# Altium schematic sheet SENSORS_SMALL_SCH.SchDoc
size A2; SheetNumber: 1; SheetTotal: 1
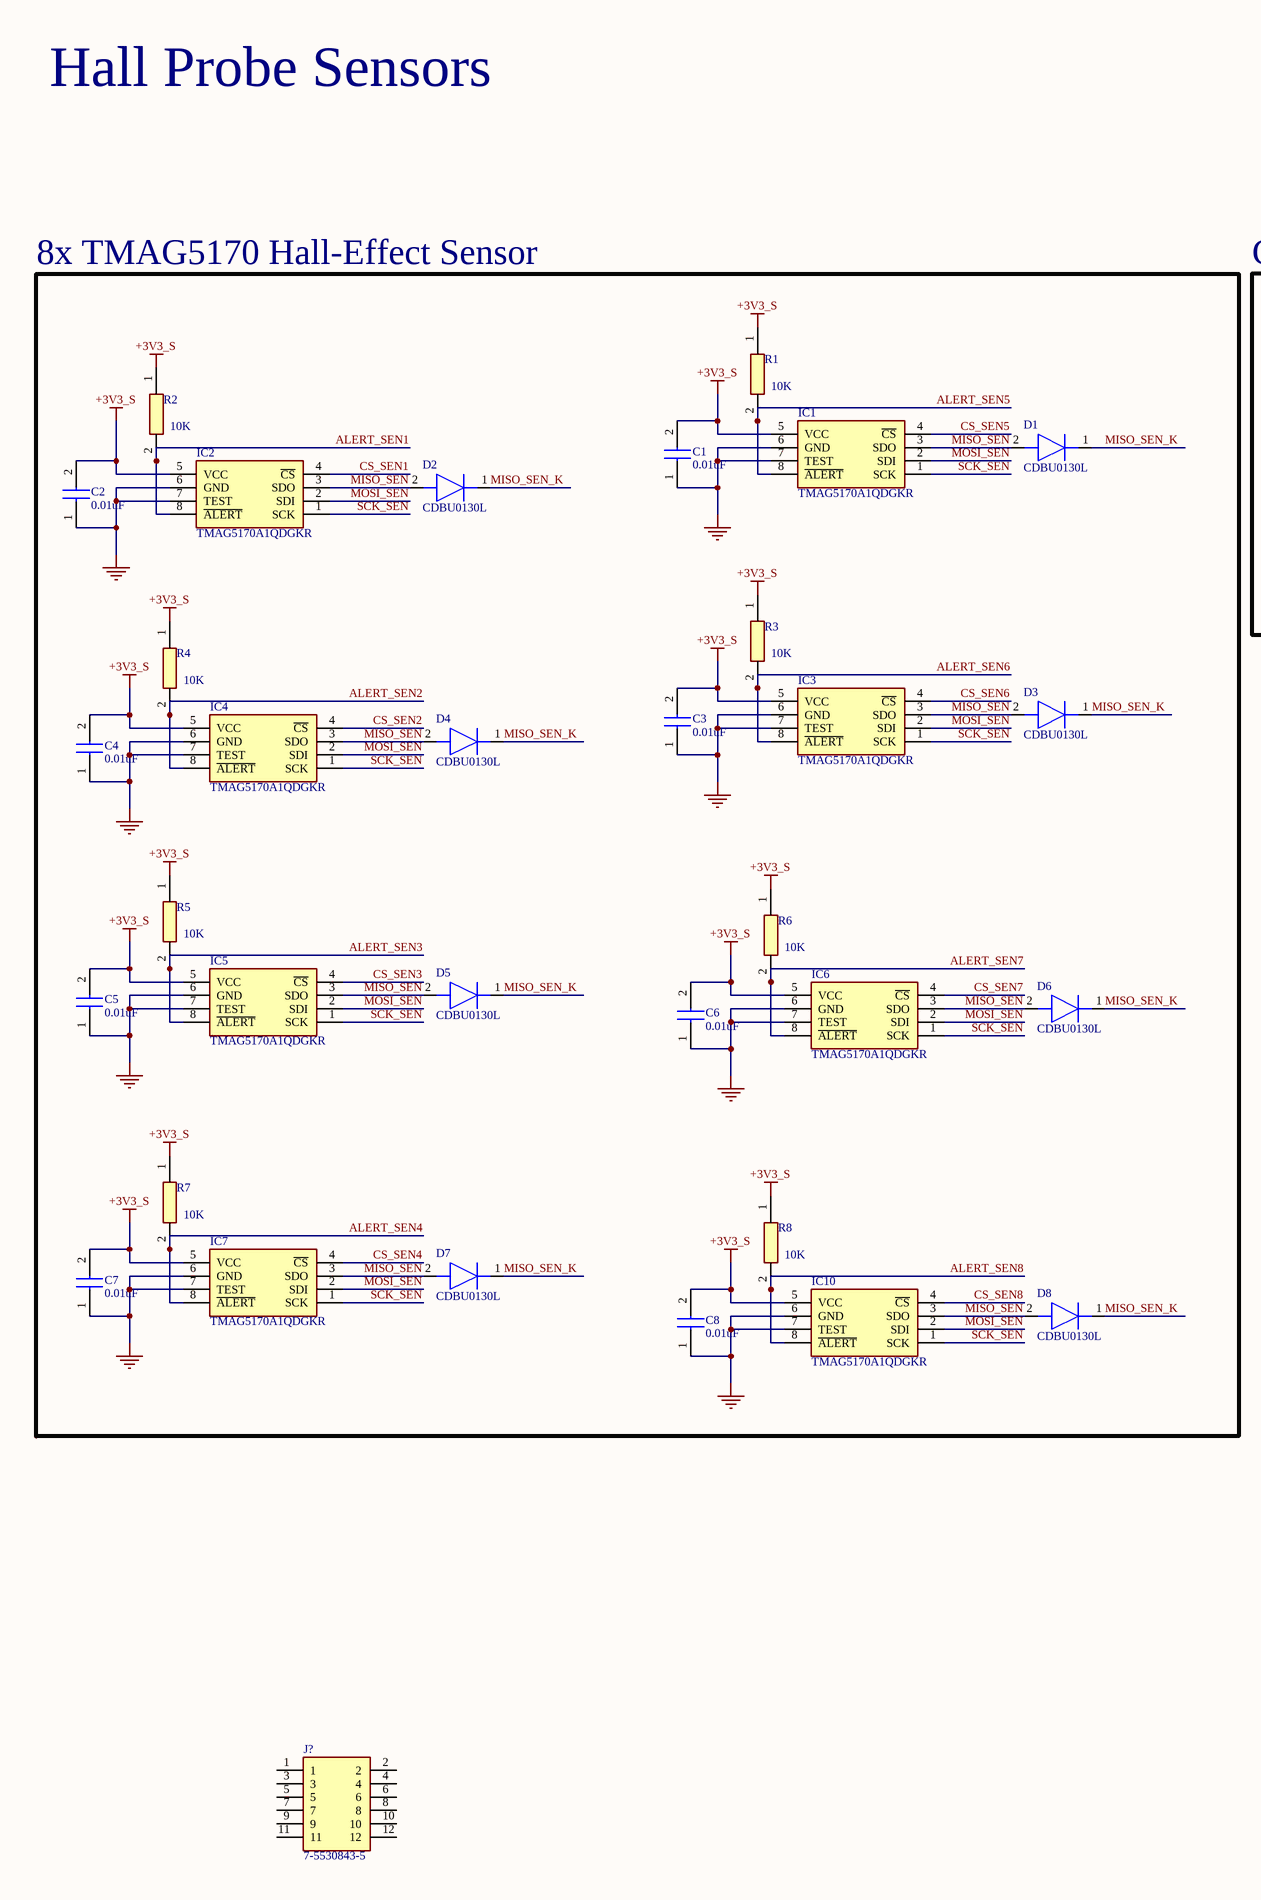
[diagram p0: SENSORS_SMALL_SCH.SchDoc, left]
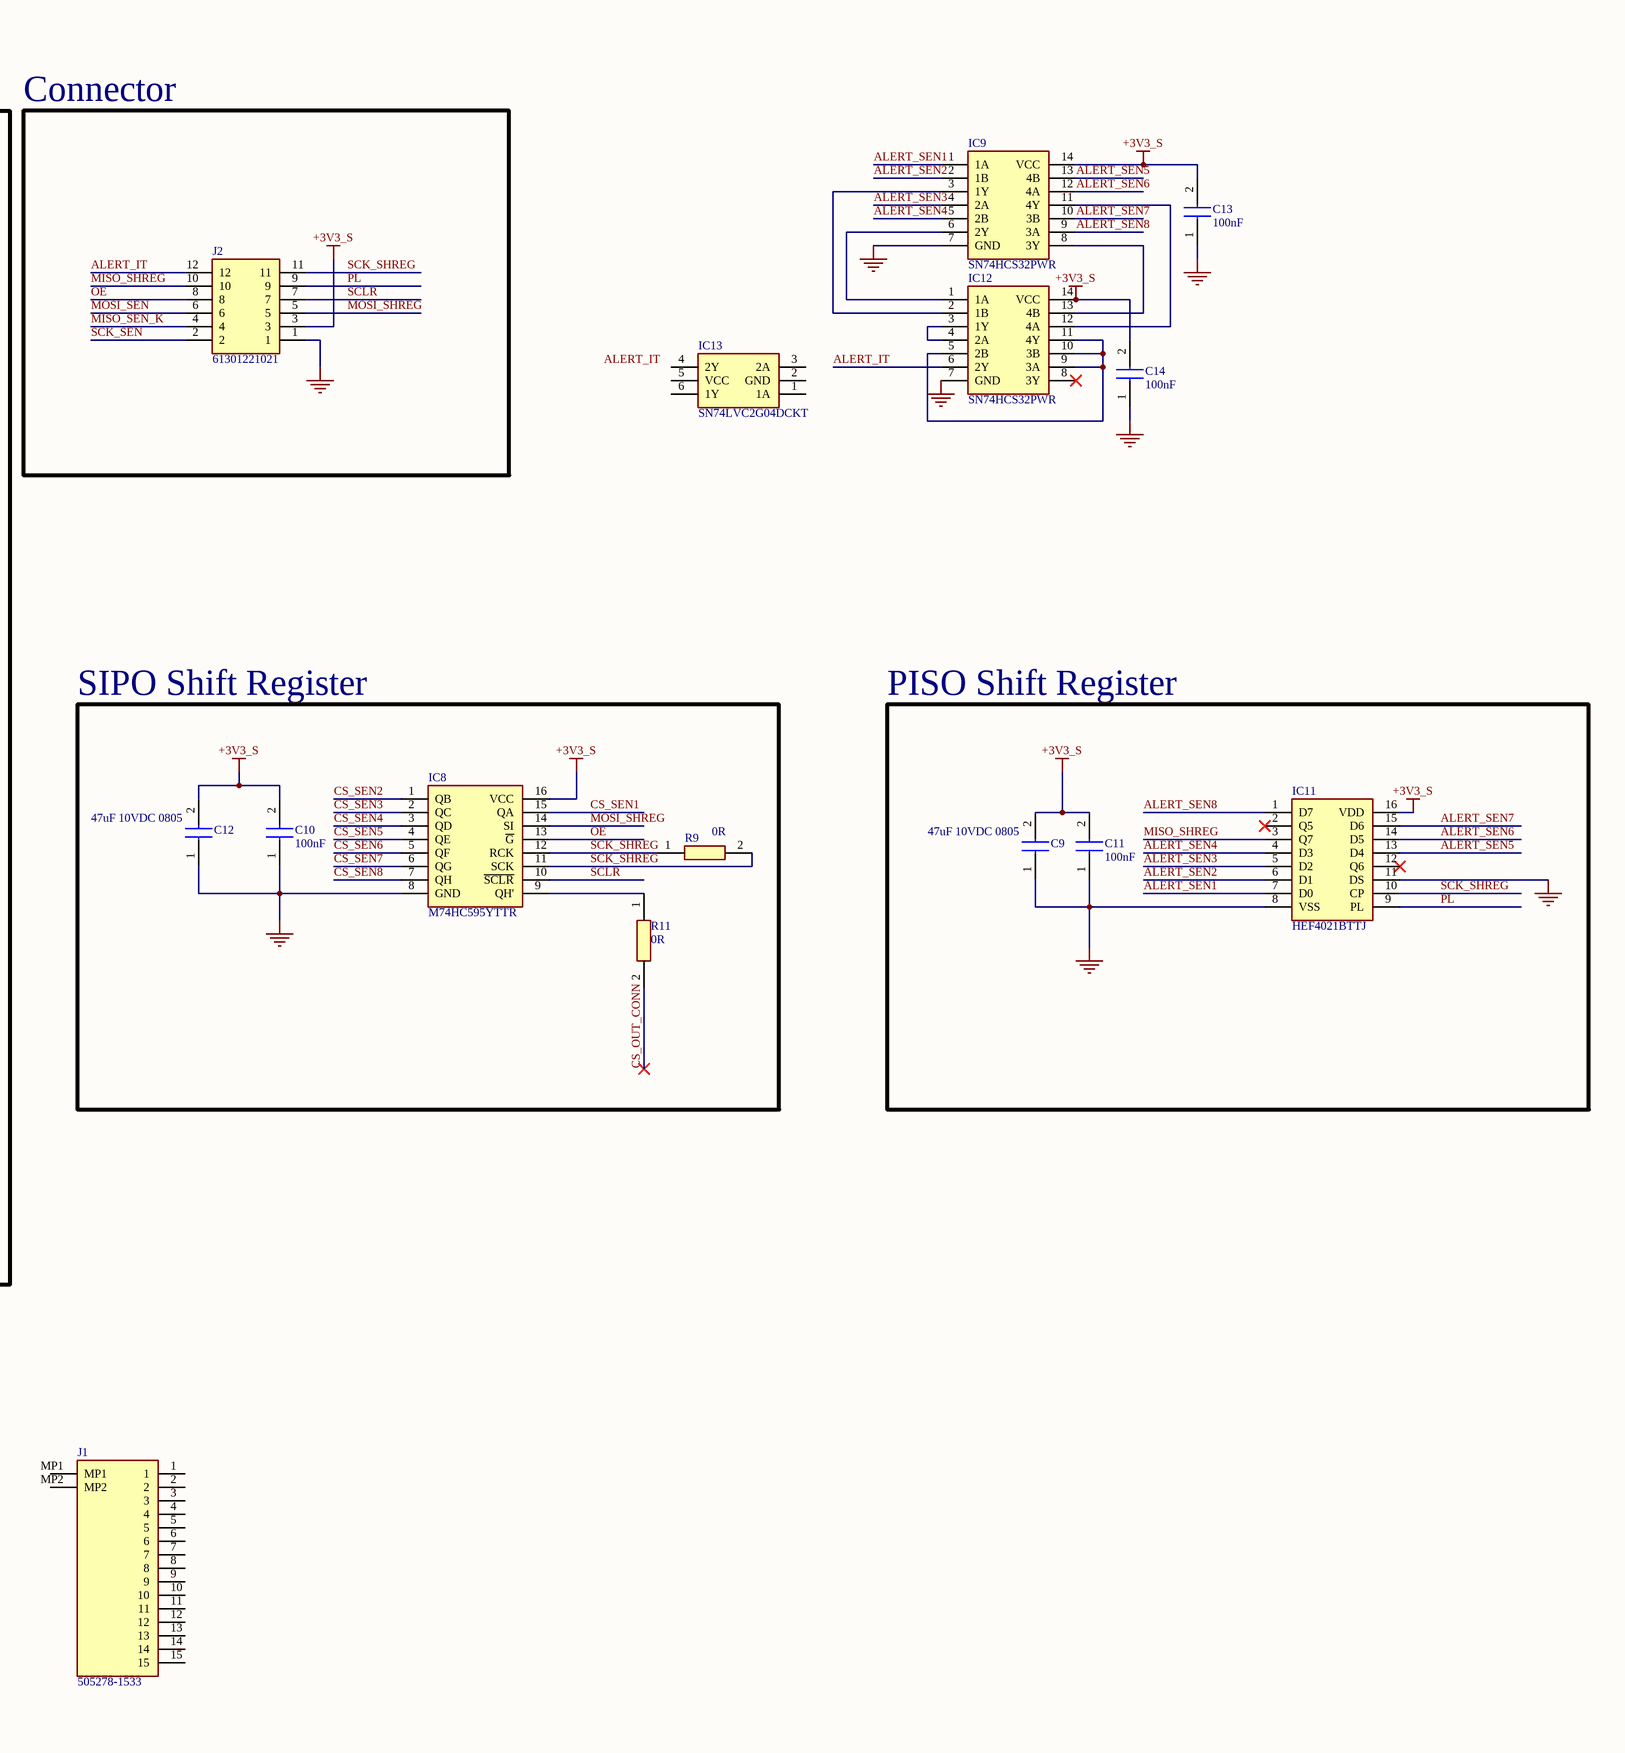
[diagram p1: SENSORS_SMALL_SCH.SchDoc, right]

## Parts
C1  0.01uF  [C0603]
C2  0.01uF  [C0603]
C3  0.01uF  [C0603]
C4  0.01uF  [C0603]
C5  0.01uF  [C0603]
C6  0.01uF  [C0603]
C7  0.01uF  [C0603]
C8  0.01uF  [C0603]
C9  47uF 10VDC 0805  [CAPC2012X145N]
C10  100nF  [CAPC1608X95N]
C11  100nF  [CAPC1608X95N]
C12  47uF 10VDC 0805  [CAPC2012X145N]
C13  100nF  [CAPC1608X95N]
C14  100nF  [CAPC1608X95N]
D1  CDBU0130L  [DIOM179X85N]
D2  CDBU0130L  [DIOM179X85N]
D3  CDBU0130L  [DIOM179X85N]
D4  CDBU0130L  [DIOM179X85N]
D5  CDBU0130L  [DIOM179X85N]
D6  CDBU0130L  [DIOM179X85N]
D7  CDBU0130L  [DIOM179X85N]
D8  CDBU0130L  [DIOM179X85N]
IC1  TMAG5170A1QDGKR  [SOP65P490X110-8N]
IC2  TMAG5170A1QDGKR  [SOP65P490X110-8N]
IC3  TMAG5170A1QDGKR  [SOP65P490X110-8N]
IC4  TMAG5170A1QDGKR  [SOP65P490X110-8N]
IC5  TMAG5170A1QDGKR  [SOP65P490X110-8N]
IC6  TMAG5170A1QDGKR  [SOP65P490X110-8N]
IC7  TMAG5170A1QDGKR  [SOP65P490X110-8N]
IC8  M74HC595YTTR  [SOP65P640X120-16N]
IC9  SN74HCS32PWR  [SOP65P640X120-14N]
IC10  TMAG5170A1QDGKR  [SOP65P490X110-8N]
IC11  HEF4021BTTJ  [SOP65P640X110-16N]
IC12  SN74HCS32PWR  [SOP65P640X120-14N]
IC13  SN74LVC2G04DCKT  [SOT65P210X110-6N]
J1  505278-1533  [5052781533]
J2  61301221021  [61301221021]
J?  7-5530843-5  [755308435]
R1  10K  [RESC1608X55N]
R2  10K  [RESC1608X55N]
R3  10K  [RESC1608X55N]
R4  10K  [RESC1608X55N]
R5  10K  [RESC1608X55N]
R6  10K  [RESC1608X55N]
R7  10K  [RESC1608X55N]
R8  10K  [RESC1608X55N]
R9  0R  [RESC1608X55N]
R11  0R  [RESC1608X55N]

## Blocks framed on the sheet
8x TMAG5170 Hall-Effect Sensor: C1-C8 D1-D8 IC1-IC7 IC10 R1-R8
Connector: J2
SIPO Shift Register: C10 C12 IC8 R9 R11
PISO Shift Register: C9 C11 IC11

## Nets
+3V3_S: C1.2 C2.2 C3.2 C4.2 C5.2 C6.2 C7.2 C8.2 C9.2 C10.2 C11.2 C12.2 C13.2 C14.2 IC1.5(VCC) IC2.5(VCC) IC3.5(VCC) IC4.5(VCC) IC5.5(VCC) IC6.5(VCC) IC7.5(VCC) IC8.16(VCC) IC9.14(VCC) IC10.5(VCC) IC11.16(VDD) IC12.14(VCC) J2.3 R1.1 R2.1 R3.1 R4.1 R5.1 R6.1 R7.1 R8.1
GND: C1.1 C2.1 C3.1 C4.1 C5.1 C6.1 C7.1 C8.1 C9.1 C10.1 C11.1 C12.1 C13.1 C14.1 IC1.6(GND) IC1.7(TEST) IC2.6(GND) IC2.7(TEST) IC3.6(GND) IC3.7(TEST) IC4.6(GND) IC4.7(TEST) IC5.6(GND) IC5.7(TEST) IC6.6(GND) IC6.7(TEST) IC7.6(GND) IC7.7(TEST) IC8.8(GND) IC9.7(GND) IC10.6(GND) IC10.7(TEST) IC11.8(VSS) IC11.11(DS) IC12.7(GND) J2.1
ALERT_IT: IC12.6(2Y) J2.12
ALERT_SEN1: IC2.8(~{ALERT}) IC9.1(1A) IC11.7(D0) R2.2
ALERT_SEN2: IC4.8(~{ALERT}) IC9.2(1B) IC11.6(D1) R4.2
ALERT_SEN3: IC5.8(~{ALERT}) IC9.4(2A) IC11.5(D2) R5.2
ALERT_SEN4: IC7.8(~{ALERT}) IC9.5(2B) IC11.4(D3) R7.2
ALERT_SEN5: IC1.8(~{ALERT}) IC9.13(4B) IC11.13(D4) R1.2
ALERT_SEN6: IC3.8(~{ALERT}) IC9.12(4A) IC11.14(D5) R3.2
ALERT_SEN7: IC6.8(~{ALERT}) IC9.10(3B) IC11.15(D6) R6.2
ALERT_SEN8: IC9.9(3A) IC10.8(~{ALERT}) IC11.1(D7) R8.2
CS_OUT_CONN: R11.2
CS_SEN1: IC2.4(~{CS}) IC8.15(QA)
CS_SEN2: IC4.4(~{CS}) IC8.1(QB)
CS_SEN3: IC5.4(~{CS}) IC8.2(QC)
CS_SEN4: IC7.4(~{CS}) IC8.3(QD)
CS_SEN5: IC1.4(~{CS}) IC8.4(QE)
CS_SEN6: IC3.4(~{CS}) IC8.5(QF)
CS_SEN7: IC6.4(~{CS}) IC8.6(QG)
CS_SEN8: IC8.7(QH) IC10.4(~{CS})
MISO_SEN: D1.2(A) D2.2(A) D3.2(A) D4.2(A) D5.2(A) D6.2(A) D7.2(A) D8.2(A) IC1.3(SDO) IC2.3(SDO) IC3.3(SDO) IC4.3(SDO) IC5.3(SDO) IC6.3(SDO) IC7.3(SDO) IC10.3(SDO)
MISO_SEN_K: D1.1(K) D2.1(K) D3.1(K) D4.1(K) D5.1(K) D6.1(K) D7.1(K) D8.1(K) J2.4
MISO_SHREG: IC11.3(Q7) J2.10
MOSI_SEN: IC1.2(SDI) IC2.2(SDI) IC3.2(SDI) IC4.2(SDI) IC5.2(SDI) IC6.2(SDI) IC7.2(SDI) IC10.2(SDI) J2.6
MOSI_SHREG: IC8.14(SI) J2.5
OE: IC8.13(~{G}) J2.8
PL: IC11.9(PL) J2.9
SCK_SEN: IC1.1(SCK) IC2.1(SCK) IC3.1(SCK) IC4.1(SCK) IC5.1(SCK) IC6.1(SCK) IC7.1(SCK) IC10.1(SCK) J2.2
SCK_SHREG: IC8.11(SCK) IC8.12(RCK) IC11.10(CP) J2.11 R9.1 R9.2
SCLR: IC8.10(~{SCLR}) J2.7
NetIC8_9: IC8.9(QH') R11.1
NetIC9_3: IC9.3(1Y) IC12.2(1B)
NetIC9_6: IC9.6(2Y) IC12.1(1A)
NetIC9_8: IC9.8(3Y) IC12.13(4B)
NetIC9_11: IC9.11(4Y) IC12.12(4A)
NetIC12_3: IC12.3(1Y) IC12.4(2A)
NetIC12_5: IC12.5(2B) IC12.9(3A) IC12.10(3B) IC12.11(4Y)

Not connected (* = marked no-connect by the designer): IC11 2(Q5)* 12(Q6)*; IC12 8(3Y)*; IC13 1(1A) 2(GND) 3(2A) 4(2Y) 5(VCC) 6(1Y); J1 1 2 3 4 5 6 7 8 9 10 11 12 13 14 15 MP1 MP2; J? 1 2 3 4 5 6 7 8 9 10 11 12

## Notes on the sheet
- Hall Probe Sensors
- Labels drawn without touching a wire or pin: ALERT_IT

## Library data of the parts
C1-C8 = C0603C103J4RACTU: Capacitor; Manufacturer_Name: KEMET; Datasheet Link: https://content.kemet.com/datasheets/KEM_C1002_X7R_SMD.pdf; Height: 0.87mm; Manufacturer_Part_Number: C0603C103J4RACTU; Mouser Part Number: 80-C0603C103J4R; Mouser Price/Stock: https://www.mouser.com/Search/Refine.aspx?Keyword=80-C0603C103J4R; Arrow Part Number: C0603C103J4RACTU; Arrow Price/Stock: https://www.arrow.com/en/products/c0603c103j4ractu/kemet-corporation
C9 C12 = GRM21BR61A476ME15K: Capacitor; Manufacturer_Name: Murata Electronics; Datasheet Link: http://www.murata.com/~/media/webrenewal/support/library/catalog/products/capacitor/mlcc/c02e.pdf; Height: 1.45mm; Manufacturer_Part_Number: GRM21BR61A476ME15K; Mouser Part Number: 81-GRM21BR61A476ME5K; Mouser Price/Stock: https://www.mouser.co.uk/ProductDetail/Murata-Electronics/GRM21BR61A476ME15K?qs=hNud%2FORuBR153XPtoO6XtA%3D%3D; Arrow Part Number: GRM21BR61A476ME15K; Arrow Price/Stock: https://www.arrow.com/en/products/grm21br61a476me15k/murata-manufacturing?region=nac
C10 C11 C13 C14 = C0603C104J4RAC: Capacitor; Manufacturer_Name: KEMET; Datasheet Link: https://datasheet.datasheetarchive.com/originals/distributors/SFDatasheet-4/sf-00083930.pdf; Height: 0.95mm; Manufacturer_Part_Number: C0603C104J4RAC; Mouser Part Number: 80-C0603C104J4RAC; Mouser Price/Stock: https://www.mouser.co.uk/ProductDetail/KEMET/C0603C104J4RAC?qs=sykUljcfnH31MXmq5HGjkg%3D%3D; Arrow Part Number: C0603C104J4RAC; Arrow Price/Stock: https://www.arrow.com/en/products/c0603c104j4rac/kemet-corporation?region=nac
D1-D8 = CDBU0130L: Diode; Manufacturer_Name: Comchip Technology; Datasheet Link: https://datasheet.datasheetarchive.com/originals/distributors/Datasheets-DGA23/1389865.pdf; Height: 0.85mm; Manufacturer_Part_Number: CDBU0130L; Mouser Part Number: 750-CDBU0130L; Mouser Price/Stock: https://www.mouser.co.uk/ProductDetail/Comchip-Technology/CDBU0130L?qs=tw%252BuQ%2FB6PO2Mup5%252Bk7mubQ%3D%3D; Arrow Part Number: CDBU0130L; Arrow Price/Stock: https://www.arrow.com/en/products/cdbu0130l/comchip-technology?region=nac
IC1-IC7 IC10 = TMAG5170A1QDGKR: Integrated Circuit; Manufacturer_Name: Texas Instruments; Datasheet Link: https://www.ti.com/lit/ds/symlink/tmag5170.pdf?ts=1631468164599&ref_url=https%253A%252F%252Fwww.ti.com%252Fsitesearch%252Fdocs%252Funiversalsearch.tsp%253FlangPref%253Den-US%2526searchTerm%253DTMAG5170A1QDGKR%2526nr%253D4; Height: 1.1mm; Manufacturer_Part_Number: TMAG5170A1QDGKR; Mouser Part Number: 595-TMAG5170A1QDGKR; Mouser Price/Stock: https://www.mouser.co.uk/ProductDetail/Texas-Instruments/TMAG5170A1QDGKR?qs=7D1LtPJG0i2KumggWL5Glw%3D%3D; Arrow Part Number: TMAG5170A1QDGKR; Arrow Price/Stock: https://www.arrow.com/en/products/tmag5170a1qdgkr/texas-instruments?region=nac
IC8 = M74HC595YTTR: Integrated Circuit; Manufacturer_Name: STMicroelectronics; Datasheet Link: https://componentsearchengine.com/Datasheets/1/M74HC595YTTR.pdf; Height: 1.2mm; Manufacturer_Part_Number: M74HC595YTTR; Mouser Part Number: 511-M74HC595YTTR; Mouser Price/Stock: https://www.mouser.co.uk/ProductDetail/STMicroelectronics/M74HC595YTTR?qs=WHlX%252B%252B9%2FRwCpo6YE5YKRQQ%3D%3D; Arrow Part Number: M74HC595YTTR; Arrow Price/Stock: https://www.arrow.com/en/products/m74hc595yttr/stmicroelectronics
IC9 IC12 = SN74HCS32PWR: Integrated Circuit; Manufacturer_Name: Texas Instruments; Datasheet Link: https://www.ti.com/lit/gpn/SN74HCS32; Height: 1.2mm; Manufacturer_Part_Number: SN74HCS32PWR; Mouser Part Number: 595-SN74HCS32PWR; Mouser Price/Stock: https://www.mouser.co.uk/ProductDetail/Texas-Instruments/SN74HCS32PWR?qs=vHuUswq2%252BswZ59iFDX%252BOFA%3D%3D; Arrow Part Number: SN74HCS32PWR; Arrow Price/Stock: https://www.arrow.com/en/products/sn74hcs32pwr/texas-instruments?region=nac
IC11 = HEF4021BTTJ: Integrated Circuit; Manufacturer_Name: Nexperia; Datasheet Link: https://assets.nexperia.com/documents/data-sheet/HEF4021B.pdf; Height: 1.1mm; Manufacturer_Part_Number: HEF4021BTTJ; Mouser Part Number: 771-HEF4021BTTJ; Mouser Price/Stock: https://www.mouser.co.uk/ProductDetail/Nexperia/HEF4021BTTJ?qs=Yna0arPQ0CSy4j38ShusdQ%3D%3D; Arrow Part Number: HEF4021BTTJ; Arrow Price/Stock: https://www.arrow.com/en/products/hef4021bttj/nexperia?region=nac
IC13 = SN74LVC2G04DCKT: Integrated Circuit; Manufacturer_Name: Texas Instruments; Datasheet Link: http://www.ti.com/lit/gpn/SN74LVC2G04; Height: 1.1mm; Manufacturer_Part_Number: SN74LVC2G04DCKT; Mouser Part Number: 595-SN74LVC2G04DCKT; Mouser Price/Stock: https://www.mouser.co.uk/ProductDetail/Texas-Instruments/SN74LVC2G04DCKT?qs=dT9u2OTAaVX2ppXnY0BN6A%3D%3D; Arrow Part Number: SN74LVC2G04DCKT; Arrow Price/Stock: https://www.arrow.com/en/products/sn74lvc2g04dckt/texas-instruments?region=nac
J1 = 505278-1533: Connector; Manufacturer_Name: Molex; Datasheet Link: https://componentsearchengine.com/Datasheets/1/505278-1533.pdf; Height: 2.15mm; Manufacturer_Part_Number: 505278-1533; Mouser Part Number: 538-505278-1533; Mouser Price/Stock: https://www.mouser.com/Search/Refine.aspx?Keyword=538-505278-1533
J2 = 61301221021: Connector; Manufacturer_Name: Wurth Elektronik; Datasheet Link: https://katalog.we-online.de/em/datasheet/6130xx21021.pdf; Height: 5.23mm; Manufacturer_Part_Number: 61301221021; Mouser Part Number: 710-61301221021; Mouser Price/Stock: https://www.mouser.co.uk/ProductDetail/Wurth-Elektronik/61301221021?qs=PhR8RmCirEb%252B3uaPvVz5Gg%3D%3D
J? = 7-5530843-5: Connector; Manufacturer_Name: TE Connectivity; Datasheet Link: https://www.te.com/commerce/DocumentDelivery/DDEController?Action=srchrtrv&DocNm=5530843&DocType=Customer+Drawing&DocLang=English&DocFormat=pdf&PartCntxt=7-5530843-5; Height: 15.494mm; Manufacturer_Part_Number: 7-5530843-5; Mouser Part Number: 571-7-5530843-5; Mouser Price/Stock: https://www.mouser.co.uk/ProductDetail/TE-Connectivity/7-5530843-5?qs=U4pz39agNJAJgkVgALCorg%3D%3D; Arrow Part Number: 7-5530843-5; Arrow Price/Stock: https://www.arrow.com/en/products/7-5530843-5/te-connectivity
R1-R9 R11 = RK73B1JTTD103J: Resistor; Manufacturer_Name: KOA Speer; Datasheet Link: http://www.koaspeer.com/catimages/Products/RK73-RT/RK73-RT.pdf; Height: 0.55mm; Manufacturer_Part_Number: RK73B1JTTD103J; Mouser Part Number: 660-RK73B1JTTD103J; Mouser Price/Stock: https://www.mouser.co.uk/ProductDetail/KOA-Speer/RK73B1JTTD103J?qs=hmtrJ2UjXcBKRTcwO9LloQ%3D%3D; Arrow Part Number: RK73B1JTTD103J; Arrow Price/Stock: https://www.arrow.com/en/products/rk73b1jttd103j/koa-speer-electronics?region=asia